# EAGLE schematic belichter-timer (EAGLE 6.5.0)
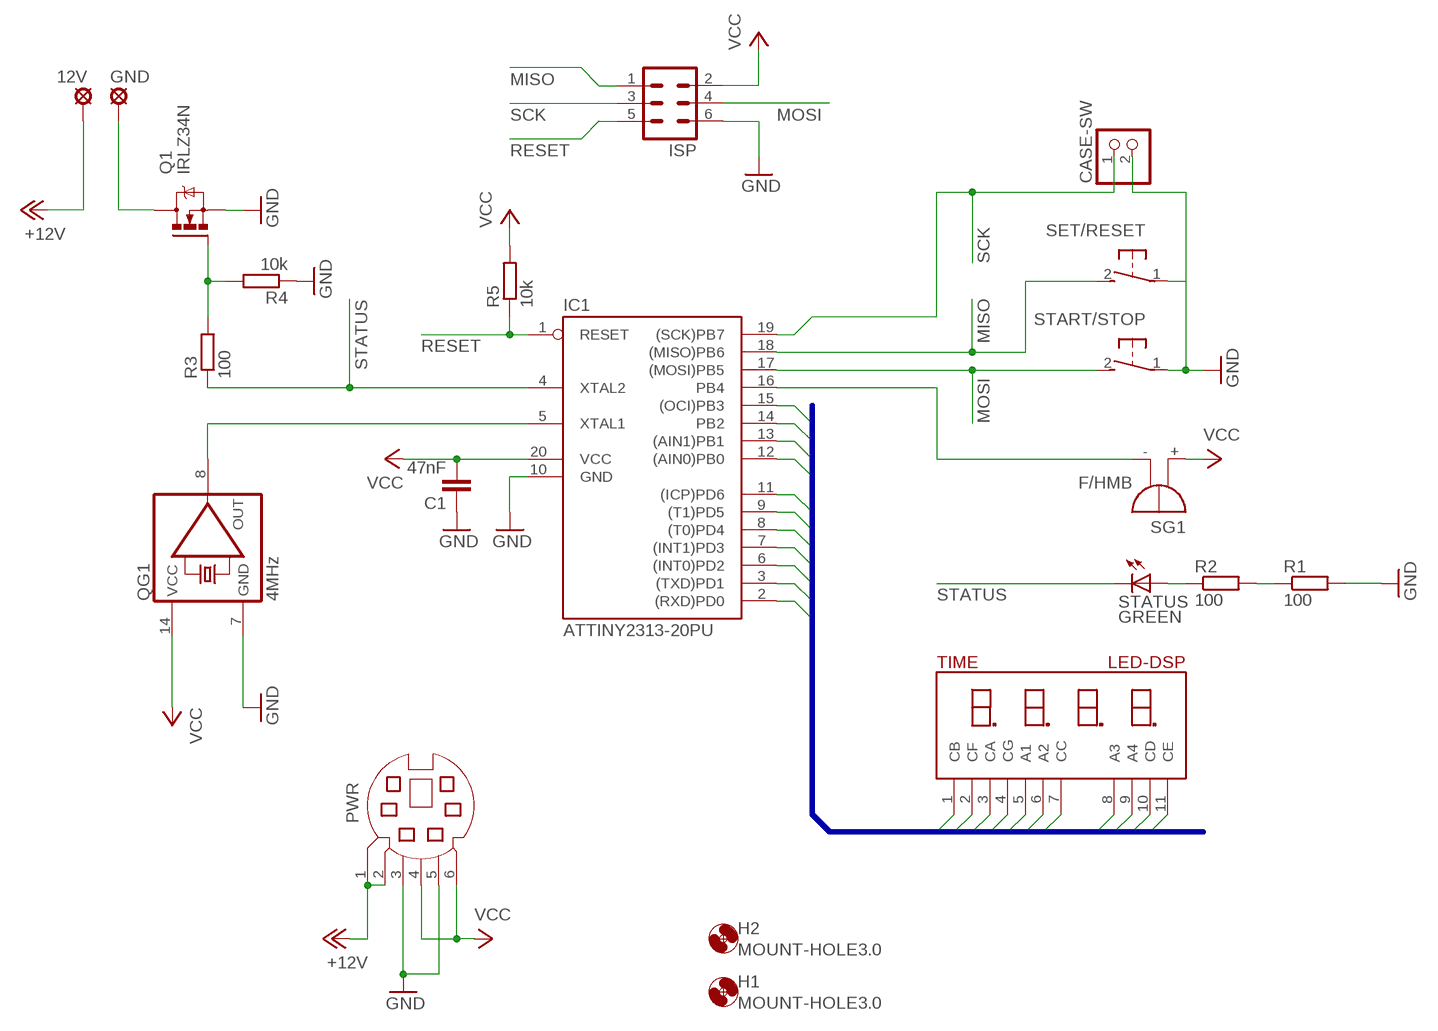
[diagram p0: schematic, sheet 1]

## Parts
12V  SE14  [SE14]
C1  47nF  C-EU075-032X103  [C075-032X103]
CASE-SW  PINHD-1X2  [1X02]
GND  SE14  [SE14]
H1  MOUNT-HOLE3.0  [3,0]
H2  MOUNT-HOLE3.0  [3,0]
IC1  ATTINY2313-20PU  AT90S2313P  [DIL20]
ISP  ML6  [ML6]
PWR  MD06SS  [MDIN06SS]
Q1  IRLZ34N  IRLZ44Z  [TO220BH]
QG1  4MHz  QG5860  [DIL14S]
R1  100  R-EU_0204/7  [0204/7]
R2  100  R-EU_0204/7  [0204/7]
R3  100  R-EU_0204/7  [0204/7]
R4  10k  R-EU_0204/7  [0204/7]
R5  10k  R-EU_0204/7  [0204/7]
SET/RESET  31-XX  [B3F-31XX]
SG1  F/HMB  [F/HMB]
START/STOP  31-XX  [B3F-31XX]
STATUS  GREEN  LED5MM  [LED5MM]
TIME  LED-DSP  [LED-DSP]

## Nets
+12V: 12V.MP PWR.1 PWR.2
CLK: IC1.5(XTAL1) QG1.8(OUT)
DP0: IC1.11((ICP)PD6) TIME.7(CC)
DP1: IC1.9((T1)PD5) TIME.6(A2)
DP2: IC1.8((T0)PD4) TIME.5(A1)
DP3: IC1.7((INT1)PD3) TIME.4(CG)
DP4: IC1.6((INT0)PD2) TIME.3(CA)
DP5: IC1.3((TXD)PD1) TIME.2(CF)
DP6: IC1.2((RXD)PD0) TIME.1(CB)
DPA: IC1.15((OCI)PB3) TIME.11(CE)
DPB: IC1.14(PB2) TIME.10(CD)
DPC: IC1.13((AIN1)PB1) TIME.9(A4)
DPD: IC1.12((AIN0)PB0) TIME.8(A3)
GND: C1.1 CASE-SW.2 IC1.10(GND) ISP.6 PWR.3 PWR.5 Q1.S QG1.7(GND) R1.2 R4.1 SET/RESET.1(P) START/STOP.1(P)
LOAD_GND: GND.MP Q1.D
MISO: IC1.18((MISO)PB6) ISP.1 SET/RESET.2(S)
MOSI: IC1.17((MOSI)PB5) ISP.4 START/STOP.2(S)
N$2: R2.1 STATUS.A
N$3: R1.1 R2.2
N$6: Q1.G R3.2 R4.2
RESET: IC1.1(RESET) ISP.5 R5.1
SCK: CASE-SW.1 IC1.19((SCK)PB7) ISP.3
SND: IC1.16(PB4) SG1.-
STATUS: IC1.4(XTAL2) R3.1 STATUS.K(C)
VCC: C1.2 IC1.20(VCC) ISP.2 PWR.4 PWR.6 QG1.14(VCC) R5.2 SG1.+

## Buses
DP[0..6],DPA,DPB,DPC,DPD

## Library data of the parts
12V GND = solpad:SE14: SOLDER PAD E1553, drill 1,4mm, distributor Buerklin, 07F820
C1 = rcl:C-EU: CAPACITOR, European symbol
CASE-SW = pinhead:PINHD-1X2: PIN HEADER
H1 H2 = holes:MOUNT-HOLE: MOUNTING HOLE with drill center marker
IC1 = atmel:AT90S2313: MICROCONTROLLER 2 Kbytes FLASH 128 bytes SRAM 128 bytes EEPROM UART; OC_FARNELL: unknown; OC_NEWARK: unknown
ISP = con-harting-ml:ML6: HARTING; OC_FARNELL: unknown; OC_NEWARK: unknown
PWR = con-yamaichi:MD06SS: YAMAICHI CONNECTOR; OC_FARNELL: unknown; OC_NEWARK: unknown
Q1 = transistor-power:IRLZ44Z: N-Channel HEXFET® Power MOSFET Logic Level AUTOMOTIVE MOSFET Source: http://www.irf.com/product-info/datasheets/data/irlz44zpbf.pdf
QG1 = crystal:QG5860: CRYSTAL RESONATOR; OC_FARNELL: unknown; OC_NEWARK: unknown
R1-R5 = rcl:R-EU_: RESISTOR, European symbol
SET/RESET START/STOP = switch-omron:31-XX: OMRON SWITCH; MPN: B3F-3100; OC_FARNELL: 959704; OC_NEWARK: 36M3582
SG1 = buzzer:F/HMB: BUZZER Source: Buerklin; OC_FARNELL: unknown; OC_NEWARK: unknown
STATUS = led:LED: LED OSRAM: - CHIPLED LG R971, LG N971, LY N971, LG Q971, LY Q971, LO R971, LY R971 LH N974, LH R974 LS Q976, LO Q976, LY Q976 LO Q996 - Hyper CHIPLED LW Q18S LB Q993, LB Q99A, LB R99A - SideLED LS A670, LO A670, LY A670, LG A670, LP A670 LB A673, LV A673, LT A673, LW A673 LH A674 LY A675 LS A676, LA A676, LO A676, LY A676, LW A676 LS A679, LY A679, LG A679 - Hyper Micro SIDELED® LS Y876, LA Y876, LO Y876, LY Y876 LT Y87S - SmartLED LW L88C, LW L88S LB L89C, LB L89S, LG L890 LS L89K, LO L89K, LY L89K LS L896, LA L896, LO L896, LY L896 - TOPLED LS T670, LO T670, LY T670, LG T670, LP T670 LSG T670, LSP T670, LSY T670, LOP T670, LYG T670 LG T671, LOG T671, LSG T671 LB T673, LV T673, LT T673, LW T673 LH T674 LS T676, LA T676, LO T676, LY T676, LB T676, LH T676, LSB T676, LW T676 LB T67C, LV T67C, LT T67C, LS T67K, LO T67K, LY T67K, LW E67C LS E67B, LA E67B, LO E67B, LY E67B, LB E67C, LV E67C, LT E67C LW T67C LS T679, LY T679, LG T679 LS T770, LO T770, LY T770, LG T770, LP T770 LB T773, LV T773, LT T773, LW T773 LH T774 LS E675, LA E675, LY E675, LS T675 LS T776, LA T776, LO T776, LY T776, LB T776 LHGB T686 LT T68C, LB T68C - Hyper Mini TOPLED® LB M676 - Mini TOPLED Santana® LG M470 LS M47K, LO M47K, LY M47K Source: http://www.osram.convergy.de LUXEON: - LUMILED® LXK2-PW12-R00, LXK2-PW12-S00, LXK2-PW14-U00, LXK2-PW14-V00 LXK2-PM12-R00, LXK2-PM12-S00, LXK2-PM14-U00 LXK2-PE12-Q00, LXK2-PE12-R00, LXK2-PE12-S00, LXK2-PE14-T00, LXK2-PE14-U00 LXK2-PB12-K00, LXK2-PB12-L00, LXK2-PB12-M00, LXK2-PB14-N00, LXK2-PB14-P00, LXK2-PB14-Q00 LXK2-PR12-L00, LXK2-PR12-M00, LXK2-PR14-Q00, LXK2-PR14-R00 LXK2-PD12-Q00, LXK2-PD12-R00, LXK2-PD12-S00 LXK2-PH12-R00, LXK2-PH12-S00 LXK2-PL12-P00, LXK2-PL12-Q00, LXK2-PL12-R00 Source: www.luxeon.com KINGBRIGHT: KA-3528ASYC Source: www.kingbright.com
TIME = led-display:LED-DSP